# Altium schematic sheet 20240714_smart_wheelchair.SchDoc: NL TB GSNL 6K3P MACH TREN
size A3; Date: T3; ApprovedBy: N.V.Quang; CheckedBy: N V Quang; Author: N.V.Quang; DrawnBy: N.V.Quang; Engineer: N.V.Quang; Organization: IOTeamVN; Address1: Số 24, Ngõ 220; Address2: Phố Bạch Mai; Address3: Hai Bà Trưng, Hà Nội; Address4: -; DocumentNumber: 01; Revision: 4.0; SheetNumber: 1; SheetTotal: 1; Time: 06:00
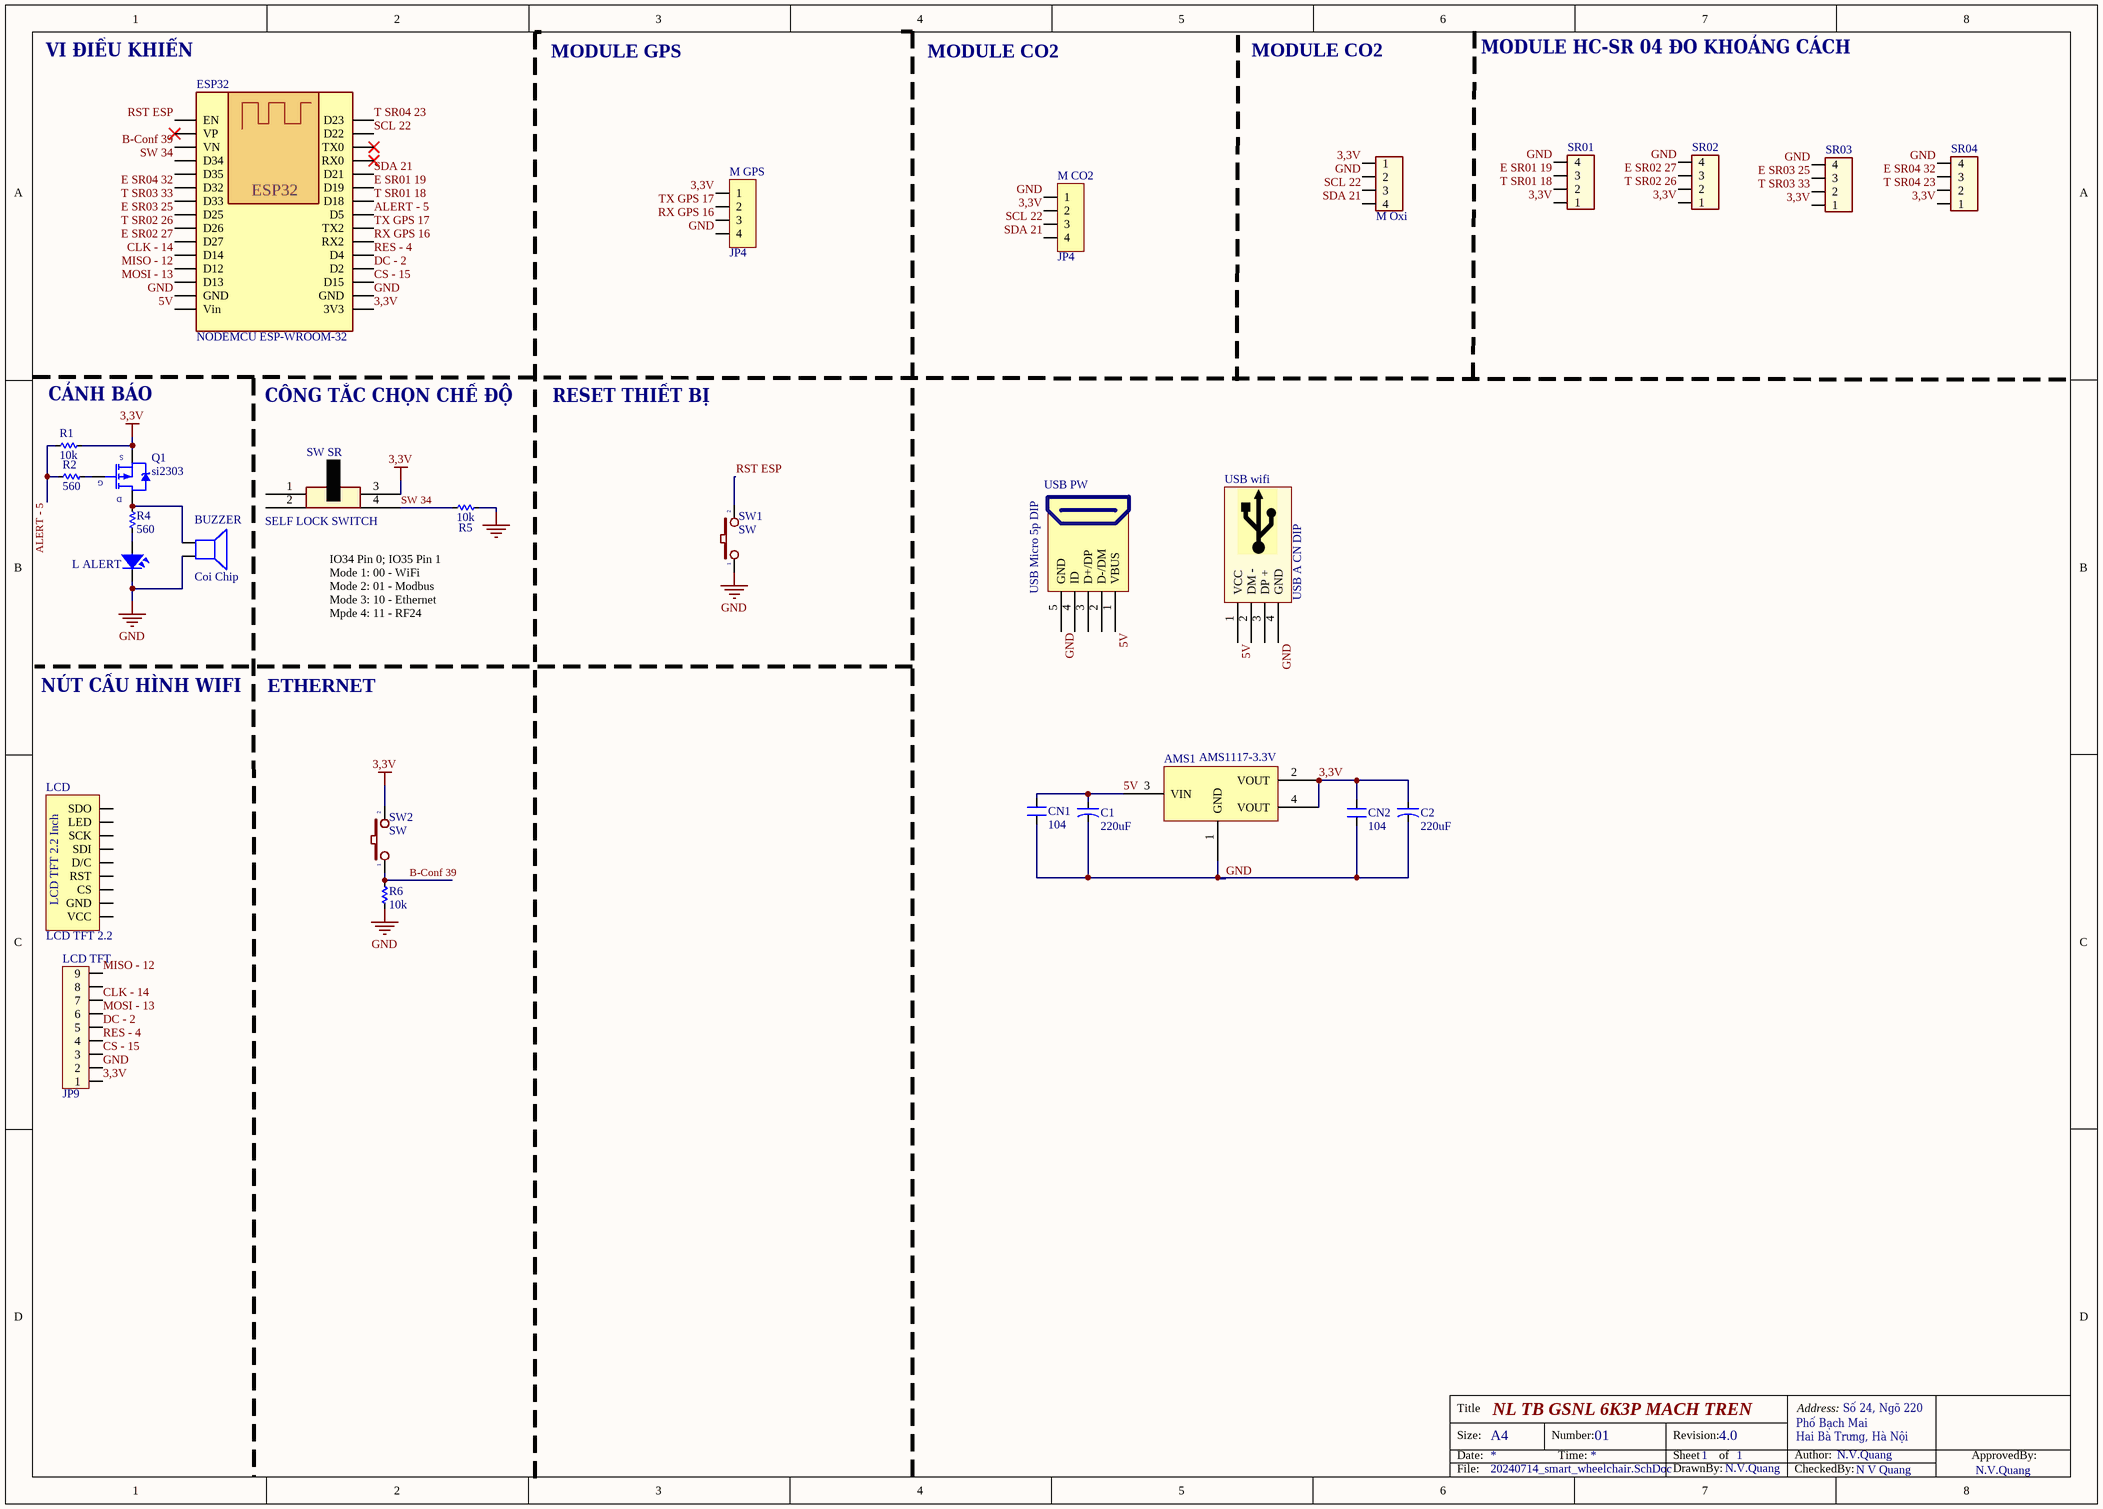
[diagram p0: 20240714_smart_wheelchair.SchDoc]

## Parts
AMS1  AMS1117-3.3V  [SOT223]
BUZZER  Coi Chip  [Coi Chip Speacker]
C1  220uF  [CA-ALU-5]
C2  220uF  [CA-ALU-5]
CN1  104  [SM-CAP-0805]
CN2  104  [SM-CAP-0805]
ESP32  NODEMCU ESP-WROOM-32  [NODEMCU ESP-WROOM-32]
L_ALERT  LED  [LED-5MM-RED]  (value not drawn)
LCD  LCD TFT 2.2  [LCD TFT 2.2]
LCD_TFT  JP9  [Header9]
M_CO2  JP4  [JP4-C1T]
M_GPS  JP4  [JP4-C1T]
M_Oxi  HP4  [Header4P Cong]  (value not drawn)
Q1  si2303  [si2303 - duplicate]
R1  10k  [RES-SMD-0805]
R2  560  [RES-SMD-0805]
R4  560  [RES-SMD-0805]
R5  10k  [RES-SMD-0805]
R6  10k  [RES-SMD-0805]
SR01  HP4  [Header4P Cong]  (value not drawn)
SR02  HP4  [Header4P Cong]  (value not drawn)
SR03  HP4  [Header4P Cong]  (value not drawn)
SR04  HP4  [Header4P Cong]  (value not drawn)
SW1  SW  [SW1-DIP]
SW2  SW  [SW1-DIP]
SW_SR  SELF LOCK SWITCH  [SW_70_31.5D47_TH_ST]
USB_PW  USB Micro 5p DIP  [USB Micro 5p DIP]
USB_wifi  USB A CN DIP  [USB A CN DIP]

## Nets
3,3V: AMS1.2(VOUT) AMS1.4(VOUT) C2.1 CN2.2 ESP32.16(3V3) LCD_TFT.1 M_CO2.2 M_GPS.1 M_Oxi.1 Q1.2(S) R1.1 SR01.1 SR02.1 SR03.1 SR04.1 SW2.2 SW_SR.3
GND: AMS1.1(GND) BUZZER.2 C1.2 C2.2 CN1.1 CN2.1 ESP32.14(GND) ESP32.17(GND) L_ALERT.2 LCD_TFT.2 M_CO2.1 M_GPS.4 M_Oxi.2 R5.1 R6.2 SR01.4 SR02.4 SR03.4 SR04.4 SW1.1 USB_PW.5(GND) USB_wifi.4(GND)
5V: AMS1.3(VIN) C1.1 CN1.2 ESP32.15(Vin) USB_PW.1(VBUS) USB_wifi.1(VCC)
ALERT - 5: ESP32.23(D5) R1.2 R2.2
B-Conf 39: ESP32.3(VN) R6.1 SW2.1
CLK - 14: ESP32.11(D14) LCD_TFT.7
CS - 15: ESP32.18(D15) LCD_TFT.3
DC - 2: ESP32.19(D2) LCD_TFT.5
E SR01 19: ESP32.25(D19) SR01.3
E SR02 27: ESP32.10(D27) SR02.3
E SR03 25: ESP32.8(D25) SR03.3
E SR04 32: ESP32.6(D32) SR04.3
MISO - 12: ESP32.12(D12) LCD_TFT.9
MOSI - 13: ESP32.13(D13) LCD_TFT.6
RES - 4: ESP32.20(D4) LCD_TFT.4
RST ESP: ESP32.1(EN) SW1.2
RX GPS 16: ESP32.21(RX2) M_GPS.3
SCL 22: ESP32.29(D22) M_CO2.3 M_Oxi.3
SDA 21: ESP32.26(D21) M_CO2.4 M_Oxi.4
SW 34: ESP32.4(D34) R5.2 SW_SR.4
T SR01 18: ESP32.24(D18) SR01.2
T SR02 26: ESP32.9(D26) SR02.2
T SR03 33: ESP32.7(D33) SR03.2
T SR04 23: ESP32.30(D23) SR04.2
TX GPS 17: ESP32.22(TX2) M_GPS.2
NetBUZZER_1: BUZZER.1 Q1.3(D) R4.1
NetL_ALERT_1: L_ALERT.1 R4.2
NetQ1_1: Q1.1(G) R2.1

Not connected (* = marked no-connect by the designer): ESP32 2(VP)* 5(D35) 27(RX0)* 28(TX0)*; LCD 1(VCC) 2(GND) 3(CS) 4(RST) 5(D/C) 6(SDI) 7(SCK) 8(LED) 9(SDO); LCD_TFT 8; SW_SR 1 2; USB_PW 2(D-/DM) 3(D+/DP) 4(ID); USB_wifi 2(DM_-) 3(DP_+)

## Notes on the sheet
- VI ĐIỀU KHIỂN
- MODULE GPS
- MODULE CO2
- MODULE HC-SR 04 ĐO KHOẢNG CÁCH
- CẢNH BÁO
- CÔNG TẮC CHỌN CHẾ ĐỘ
- RESET THIẾT BỊ
- IO34 Pin 0; IO35 Pin 1
  Mode 1: 00 - WiFi
  Mode 2: 01 - Modbus
  Mode 3: 10 - Ethernet
  Mpde 4: 11 - RF24
- NÚT CẤU HÌNH WIFI
- ETHERNET
- Title
- Size:
- Date:
- A4
- Number:
- Time:
- Revision:
- Sheet
- of
- Author:
- Address:
- ApprovedBy:
- File:
- DrawnBy:
- CheckedBy:
- (in symbol LCD TFT 2.2) LCD TFT 2.2 Inch

## Library data of the parts
AMS1 = AMS1117 SMD: Dán; Value: AMS1117-3.3V SOT223; Don_Vi: Con; Ma_Hang: MH000596; Ghi_Chu: *; Kieu_Chan: *; Chung_Loai: Dán
BUZZER = Coi Chip Speaker: Còi chip
C1 C2 = CN-ALU-DIP: Capacitor (Semiconductor SIM Model); Value: 104; LatestRevisionDate: 17-Jul-2002; LatestRevisionNote: Re-released for DXP Platform.; PackageReference: C1206; Publisher: Altium Limited
CN1 CN2 = CN: 0805; 0603; Value: 0.1uF
L_ALERT = LED: LED Single colour Green and Red; Value: LED 3 ly Single Colour
LCD = LCD TFT 2.2: Manufacturer: W¨¹rth Elektronik eiSos GmbH; partNo: 613009143121; ComponentLink1 Description: Manufacturer; ComponentLink2 Description: Datasheet; NoPins: 09; Created Date: 29 March 2013; ComponentLink1URL: http://www.we-online.com; ComponentLink2URL: http://katalog.we-online.de/em/datasheet/6130xx143121.pdf; Created by: Karrer Zheng
LCD_TFT = Header9: Connector 9; Value: Connector 9
M_CO2 M_GPS = JP4: WR-PHD 2.54 mm Angled Socket Header; Manufacturer: W¨¹rth Elektronik eiSos GmbH; partNo: 613004143121; ComponentLink1 Description: Manufacturer; ComponentLink2 Description: Datasheet; NoPins: 04; Created Date: 29 March 2013; ComponentLink1URL: http://www.we-online.com; ComponentLink2URL: http://katalog.we-online.de/em/datasheet/6130xx143121.pdf; Created by: Karrer Zheng
M_Oxi SR01 SR02 SR03 SR04 = Header4P: Value: Connector 4
Q1 = Si2303: Value: IRF840
R1 R2 R4-R6 = Res-SMD: Resistor; Manufacturer: Generic Components; Class: Passive; Published: 08/06/2000; Publisher: Altium Hobart Technology Centre
SW1 SW2 = SW2: Switch button 2 pin; Value: SW chip 2 pin
SW_SR = SW1_LOCAL-TH: 6 Pin DPDT Mini Push Button Self-locking Switch Multimeter Switch; Manufacturer Part Number: NA; Case/Package: TH; Manufacturer: NA; Supplier-1: SP ROAD; Supplier Part Number-1: NA; Alternate Part Number-1: NA
USB_PW = USB Micro 5p DIP: USB Type B; Ten: MicroUSB MK5P DIP; Ma_Hang: MH005145
USB_wifi = USB A CN DIP: USB Type A; Ten: USB A Cái DIP; Ma_Hang: MH000941